# Altium schematic sheet HeartAware_AnalogSensorControl.SchDoc: Analog Sensor Control
size Legal; Author: M. Holachek; DocumentNumber: HA-101-2; Revision: 1; SheetNumber: 2; SheetTotal: 2; Copyright: Copyright 2015.; ProjectName: HeartAware
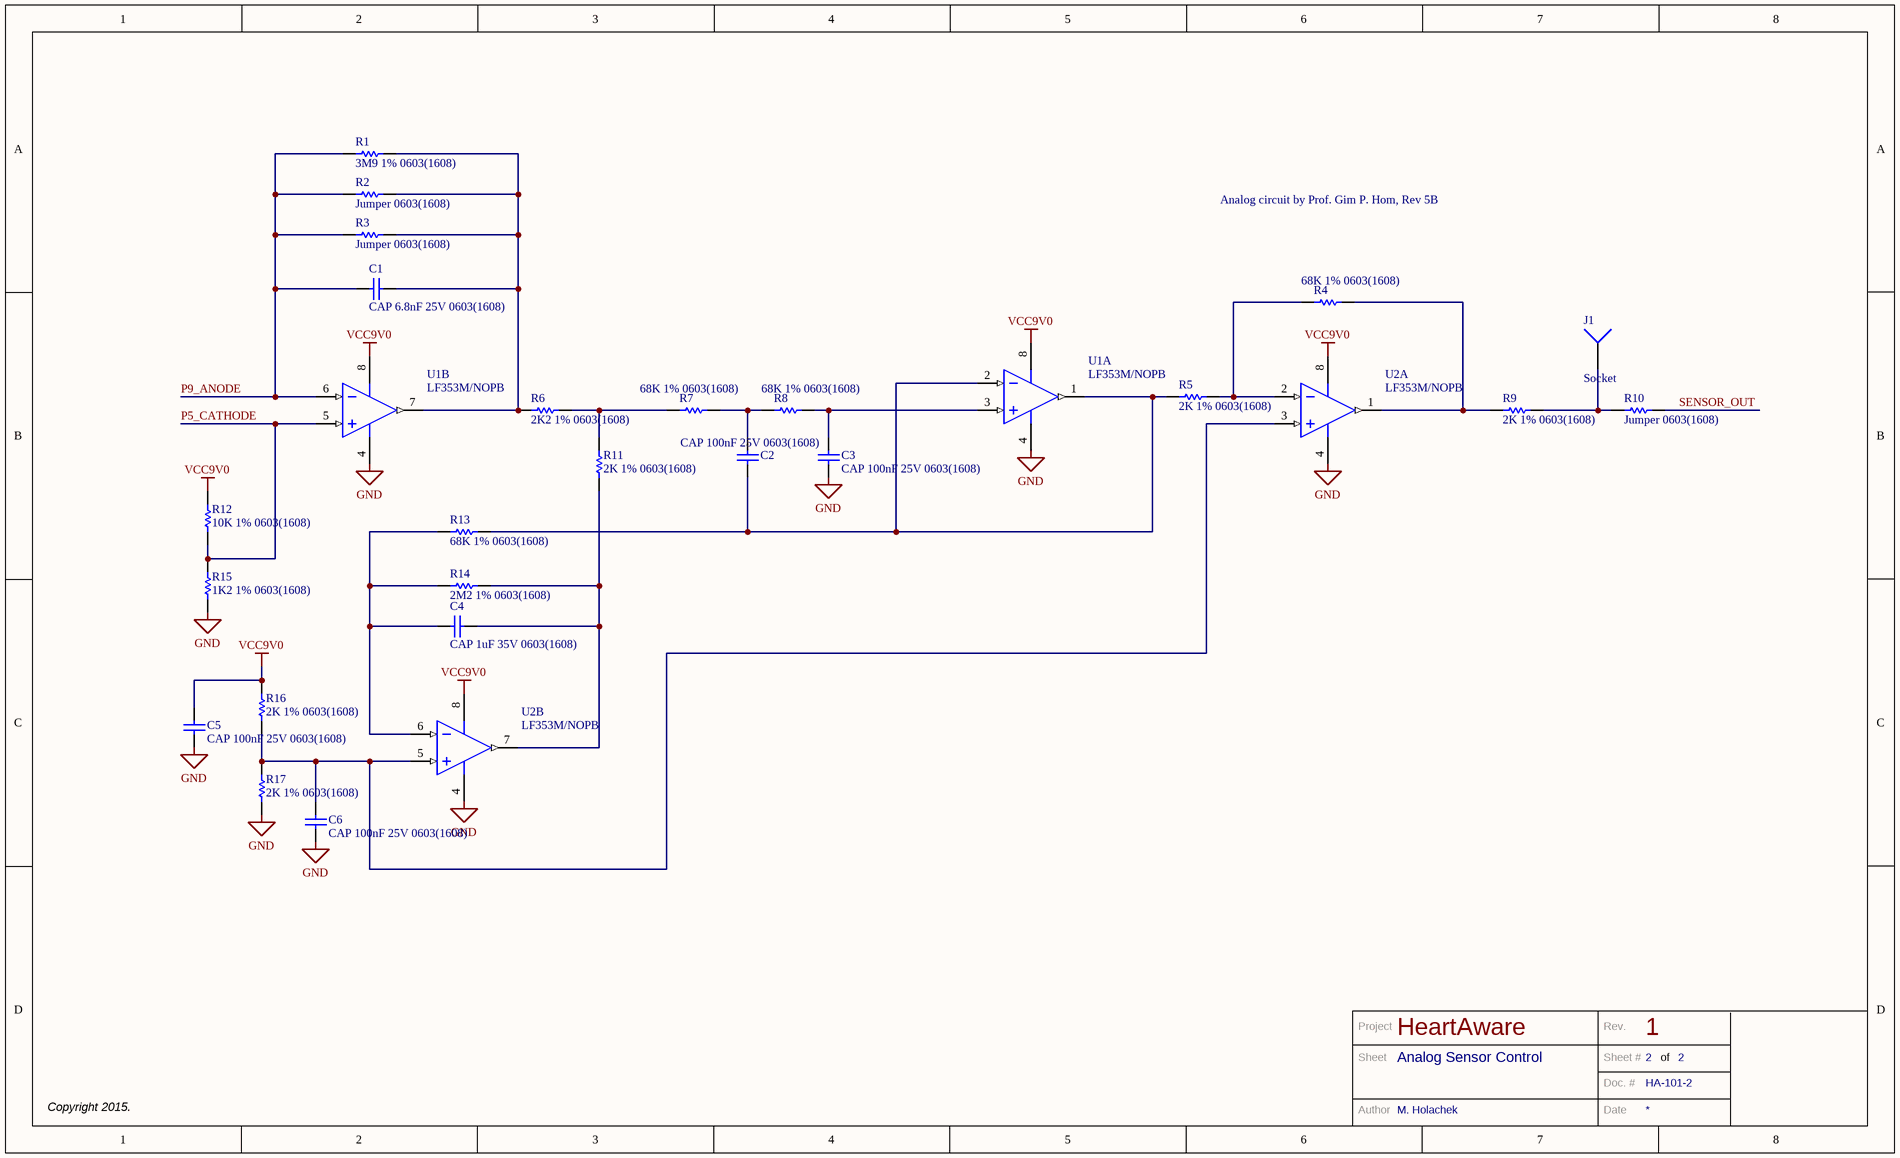
[diagram p0: HeartAware_AnalogSensorControl.SchDoc]

## Parts
C1  CAP 6.8nF 25V 0603(1608)  [CAPC0603(1608)100_N]
C2  CAP 100nF 25V 0603(1608)  [CAPC0603(1608)100_M]
C3  CAP 100nF 25V 0603(1608)  [CAPC0603(1608)100_M]
C4  CAP 1uF 35V 0603(1608)  [CAPC0603(1608)100_L]
C5  CAP 100nF 25V 0603(1608)  [CAPC0603(1608)100_M]
C6  CAP 100nF 25V 0603(1608)  [CAPC0603(1608)100_M]
J1  Socket  [PIN1]
R1  3M9 1% 0603(1608)  [RESC0603(1608)_M]
R2  Jumper 0603(1608)  [RESC0603(1608)_N]
R3  Jumper 0603(1608)  [RESC0603(1608)_N]
R4  68K 1% 0603(1608)  [RESC0603(1608)_M]
R5  2K 1% 0603(1608)  [RESC0603(1608)_N]
R6  2K2 1% 0603(1608)  [RESC0603(1608)_L]
R7  68K 1% 0603(1608)  [RESC0603(1608)_M]
R8  68K 1% 0603(1608)  [RESC0603(1608)_M]
R9  2K 1% 0603(1608)  [RESC0603(1608)_N]
R10  Jumper 0603(1608)  [RESC0603(1608)_N]
R11  2K 1% 0603(1608)  [RESC0603(1608)_N]
R12  10K 1% 0603(1608)  [RESC0603(1608)_N]
R13  68K 1% 0603(1608)  [RESC0603(1608)_M]
R14  2M2 1% 0603(1608)  [RESC0603(1608)_M]
R15  1K2 1% 0603(1608)  [RESC0603(1608)_M]
R16  2K 1% 0603(1608)  [RESC0603(1608)_N]
R17  2K 1% 0603(1608)  [RESC0603(1608)_N]
U1  LF353M/NOPB  [M08A_M]  (parts A,B of 2)
U2  LF353M/NOPB  [M08A_M]  (parts A,B of 2)

## Nets
GND: C3.1 C5.1 C6.1 R15.1 R17.1 U1.4(V-) U2.4(V-)
VCC9V0: C5.2 R12.1 R16.2 U1.8(V+) U2.8(V+)
P5_CATHODE: R12.2 R15.2 U1.5(INB+)
P9_ANODE: C1.1 R1.1 R2.1 R3.1 U1.6(INB-)
SENSOR_OUT: R10.2
NetC1_2: C1.2 R1.2 R2.2 R3.2 R6.1 U1.7(OUTB)
NetC2_1: C2.1 R5.1 R13.1 U1.1(OUTA) U1.2(INA-)
NetC2_2: C2.2 R7.2 R8.1
NetC3_2: C3.2 R8.2 U1.3(INA+)
NetC4_1: C4.1 R13.2 R14.1 U2.6(INB-)
NetC4_2: C4.2 R11.1 R14.2 U2.7(OUTB)
NetC6_2: C6.2 R16.1 R17.2 U2.3(INA+) U2.5(INB+)
NetJ1_1: J1.1 R9.2 R10.1
NetR4_1: R4.1 R5.2 U2.2(INA-)
NetR4_2: R4.2 R9.1 U2.1(OUTA)
NetR6_2: R6.2 R7.1 R11.2

## Notes on the sheet
- Analog circuit by Prof. Gim P. Hom, Rev 5B
- Project
- Rev.
- Sheet
- Author
- Doc. #
- Sheet #
- Date
- of

## Library data of the parts
C1 = CMP-1035-02265-1: CAP 6.8nF 25V Â±20% 0603 (1608 Metric) Thickness 1mm SMD; Case-EIA: 0603; Case-Metric: 1608; Tolerance: Â±20%; Technology: SMT; Value: 6.8nF; Rated Voltage: 25 V; Max Thickness: 1 mm
C2 C3 C5 C6 = CMP-1035-02588-1: CAP 100nF 25V Â±10% 0603 (1608 Metric) Thickness 1mm SMD; Case-Metric: 1608; Case-EIA: 0603; Max Thickness: 1 mm; Technology: SMT; Rated Voltage: 25 V; Value: 100nF; Tolerance: Â±10%
C4 = CMP-1035-02743-1: CAP 1uF 35V Â±10% 0603 (1608 Metric) Thickness 1mm SMD; Case-Metric: 1608; Case-EIA: 0603; Max Thickness: 1 mm; Value: 1uF; Technology: SMT; Rated Voltage: 35 V; Tolerance: Â±10%
R1 = CMP-1012-00915-1: 3M9 0.1W 1% 0603 (1608 Metric)  SMD; Case-EIA: 0603; Case-Metric: 1608; Value: 3900000.00 Ohm; Power: 0.1 W; Technology: SMT; Tolerance: 1 %
R2 R3 R10 = CMP-1012-00001-1: Jumper 0603 (1608 Metric); Case-Metric: 1608; Value: 0.00 Ohm; Power: None; Case-EIA: 0603; Technology: SMT; Tolerance: None
R4 R7 R8 R13 = CMP-1012-00717-1: 68K 0.1W 1% 0603 (1608 Metric)  SMD; Value: 68000.00 Ohm; Case-EIA: 0603; Case-Metric: 1608; Power: 0.1 W; Technology: SMT; Tolerance: 1 %
R5 R9 R11 R16 R17 = CMP-1012-00542-1: 2K 0.1W 1% 0603 (1608 Metric)  SMD; Case-EIA: 0603; Value: 2000.00 Ohm; Case-Metric: 1608; Power: 0.1 W; Technology: SMT; Tolerance: 1 %
R6 = CMP-1012-00546-1: 2K2 0.1W 1% 0603 (1608 Metric)  SMD; Case-EIA: 0603; Value: 2200.00 Ohm; Case-Metric: 1608; Tolerance: 1 %; Power: 0.1 W; Technology: SMT
R12 = CMP-1012-00623-1: 10K 0.1W 1% 0603 (1608 Metric)  SMD; Value: 10000.00 Ohm; Case-EIA: 0603; Case-Metric: 1608; Power: 0.1 W; Tolerance: 1 %; Technology: SMT
R14 = CMP-1012-00885-1: 2M2 0.1W 1% 0603 (1608 Metric)  SMD; Case-EIA: 0603; Value: 2200000.00 Ohm; Case-Metric: 1608; Tolerance: 1 %; Power: 0.1 W; Technology: SMT
R15 = CMP-1012-00518-1: 1K2 0.1W 1% 0603 (1608 Metric)  SMD; Case-EIA: 0603; Value: 1200.00 Ohm; Case-Metric: 1608; Power: 0.1 W; Technology: SMT; Tolerance: 1 %
U1 U2 = CMP-0055-00856-2: Wide Bandwidth Dual JFET Input Operational Amplifier, 8-pin Narrow SOIC, Pb-Free; Manufacturer: National Semiconductor; PowerWise: N; CompType: Amplifiers; PackageTopMarking: NSZXTT*LF353*M; ComponentLink1URL: http://www.national.com/ds/LF/LF353.pdf; PackageReference: M08A; RevisionNote: Component URLs added; ComponentLink3Description: M08A Package Page; ComponentLink1Description: LF353 Datasheet; Code_IPC: SOIC127P600-8; Code_JEDEC: MS-012-AA; ComponentLink2Description: LF353 Web Page; RoHS: Y; PackageDescription: SOIC Narrow, 4.9 x 3.9 x 1.45mm, 8 Lead, 1.27mm Pitch; DatasheetVersion: Dec-2003; PackageVersion: revM, May-2009; PinCount: 8; ComponentLink3URL: http://www.national.com/packaging/folders/m08a.html; ComponentLink2URL: http://www.national.com/pf/LF/LF353.html
J1 = Socket: LatestRevisionDate: 17-Jul-2002; LatestRevisionNote: Re-released for DXP Platform.; Publisher: Altium Limited